# EAGLE schematic hobbyLights (EAGLE 7.6.0)

## Sheet 1 of 2
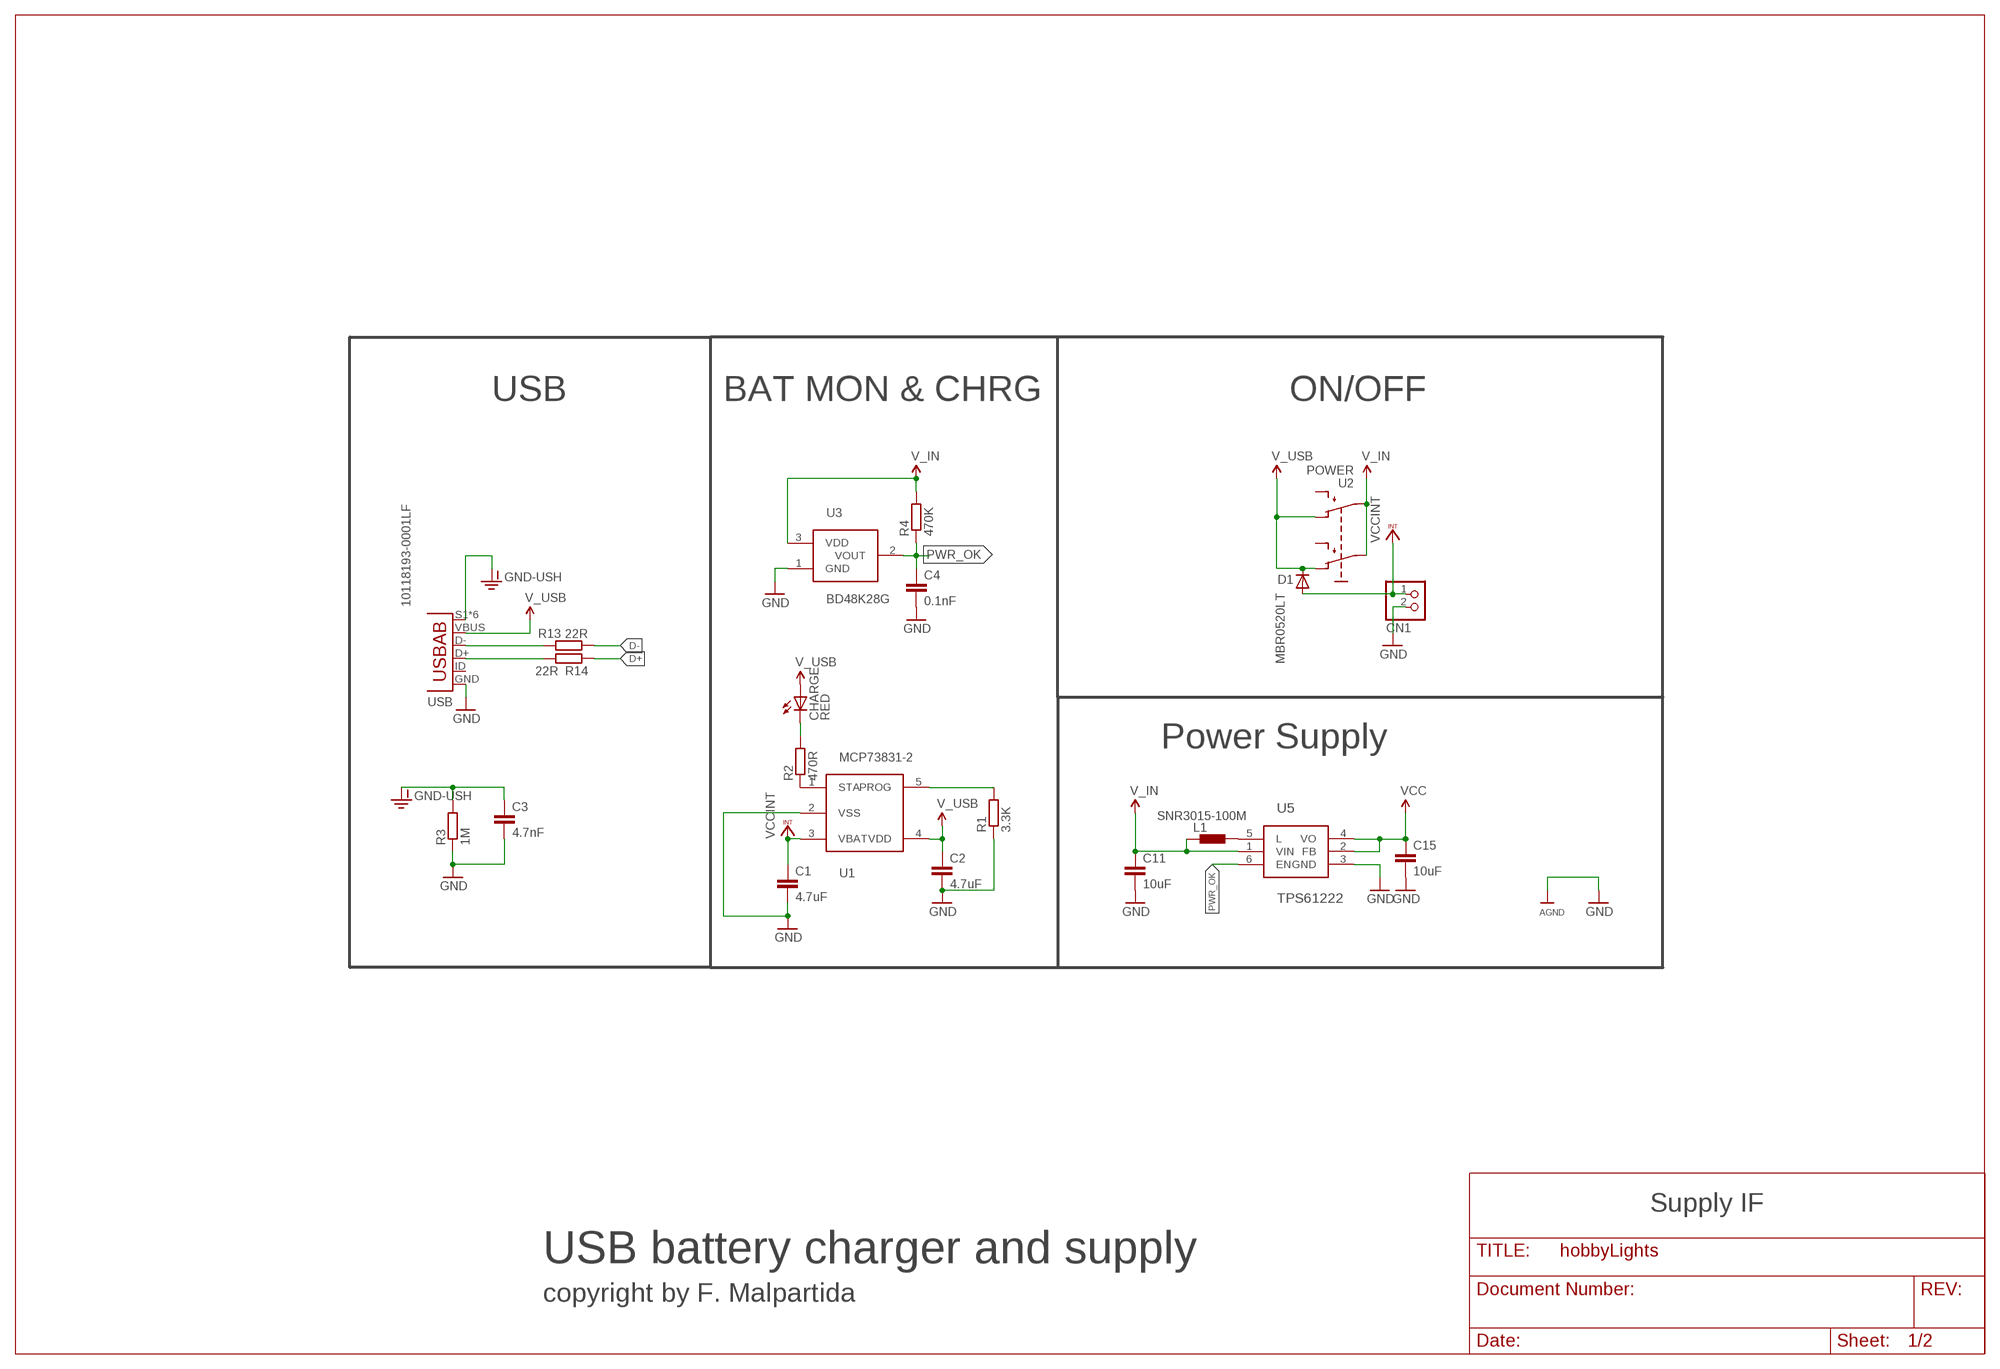
[diagram p0: schematic, sheet 1]

### Parts
C1  4.7uF  C-EUC0805  [C0805]
C2  4.7uF  C-EUC0805  [C0805]
C3  4.7nF  C-EUC0603  [C0603]
C4  0.1nF  C-EUC0603  [C0603]
C11  10uF  C-EUC0805  [C0805]
C15  10uF  C-EUC0805  [C0805]
CHARGE  RED  LEDCHIPLED_0805  [CHIPLED_0805]
CN1  JST_2PIN-THM-RA  [JST-PH-2-THM-RA]
D1  MBR0520LT  [SOD123]
L1  SNR3015-100M  SRN3015  [SRN3015]
R1  3.3K  R-EU_R0603  [R0603]
R2  470R  R-EU_R0603  [R0603]
R3  1M  R-EU_R0603  [R0603]
R4  470K  R-EU_R0603  [R0603]
R13  22R  R-EU_R0603  [R0603]
R14  22R  R-EU_R0603  [R0603]
U1  MCP73831-2  [SOT23-5]
U2  POWER  MINI_SWITCH  [SWITCH-JS202011]
U3  BD48K28G  BD48XXXBD48XXK  [SSOP3]
U5  TPS61222  [DCK]
USB  10118193-0001LF  USB_MICRO_AB10118193-0001LF  [USB_MICRO_B]

### Nets
D+: R14.1 ; also sheet 2
D-: R13.1 ; also sheet 2
GND: C1.2 C2.2 C3.2 C4.2 C11.2 C15.2 CN1.2 R1.1 R3.1 U1.2(VSS) U3.1(GND) U5.3(GND) USB.GND ; supply symbol labelled AGND ; also sheet 2
GND-ISO: C3.1 R3.2 USB.S1(SHIELD) USB.S2(SHIELD) USB.S3(SHIELD) USB.S4(SHIELD) USB.S5(SHIELD) USB.S6(SHIELD) ; supply symbol labelled GND-USH
N$4: R1.2 U1.5(PROG)
N$6: R2.1 U1.1(STA)
N$7: CHARGE.C R2.2
N$13: R13.2 USB.D-
N$14: R14.2 USB.D+
N$15: L1.2 U5.5(L)
PWR_OK: C4.1 R4.1 U3.2(VOUT) U5.6(EN)
V_BATT [vcc]: C11.1 L1.1 R4.2 U2.P2(P) U2.P5(P1) U3.3(VDD) U5.1(VIN) ; supply symbol labelled V_IN ; also sheet 2
V_USB [vcc]: C2.1 CHARGE.A D1.C U1.4(VDD) U2.P1(O) U2.P4(O1) USB.VBUS
VCC [vcc]: C15.1 U5.2(FB) U5.4(VO) ; also sheet 2
VCCINT [vcc]: C1.1 CN1.1 D1.A U1.3(VBAT)
Unconnected: U2.P3(S) U2.P6(S1) USB.ID(USBID)

### Notes on the sheet
- USB | BAT MON & CHRG | ON/OFF
- Power Supply
- Supply IF
- USB battery charger and supply
- copyright by F. Malpartida

## Sheet 2 of 2
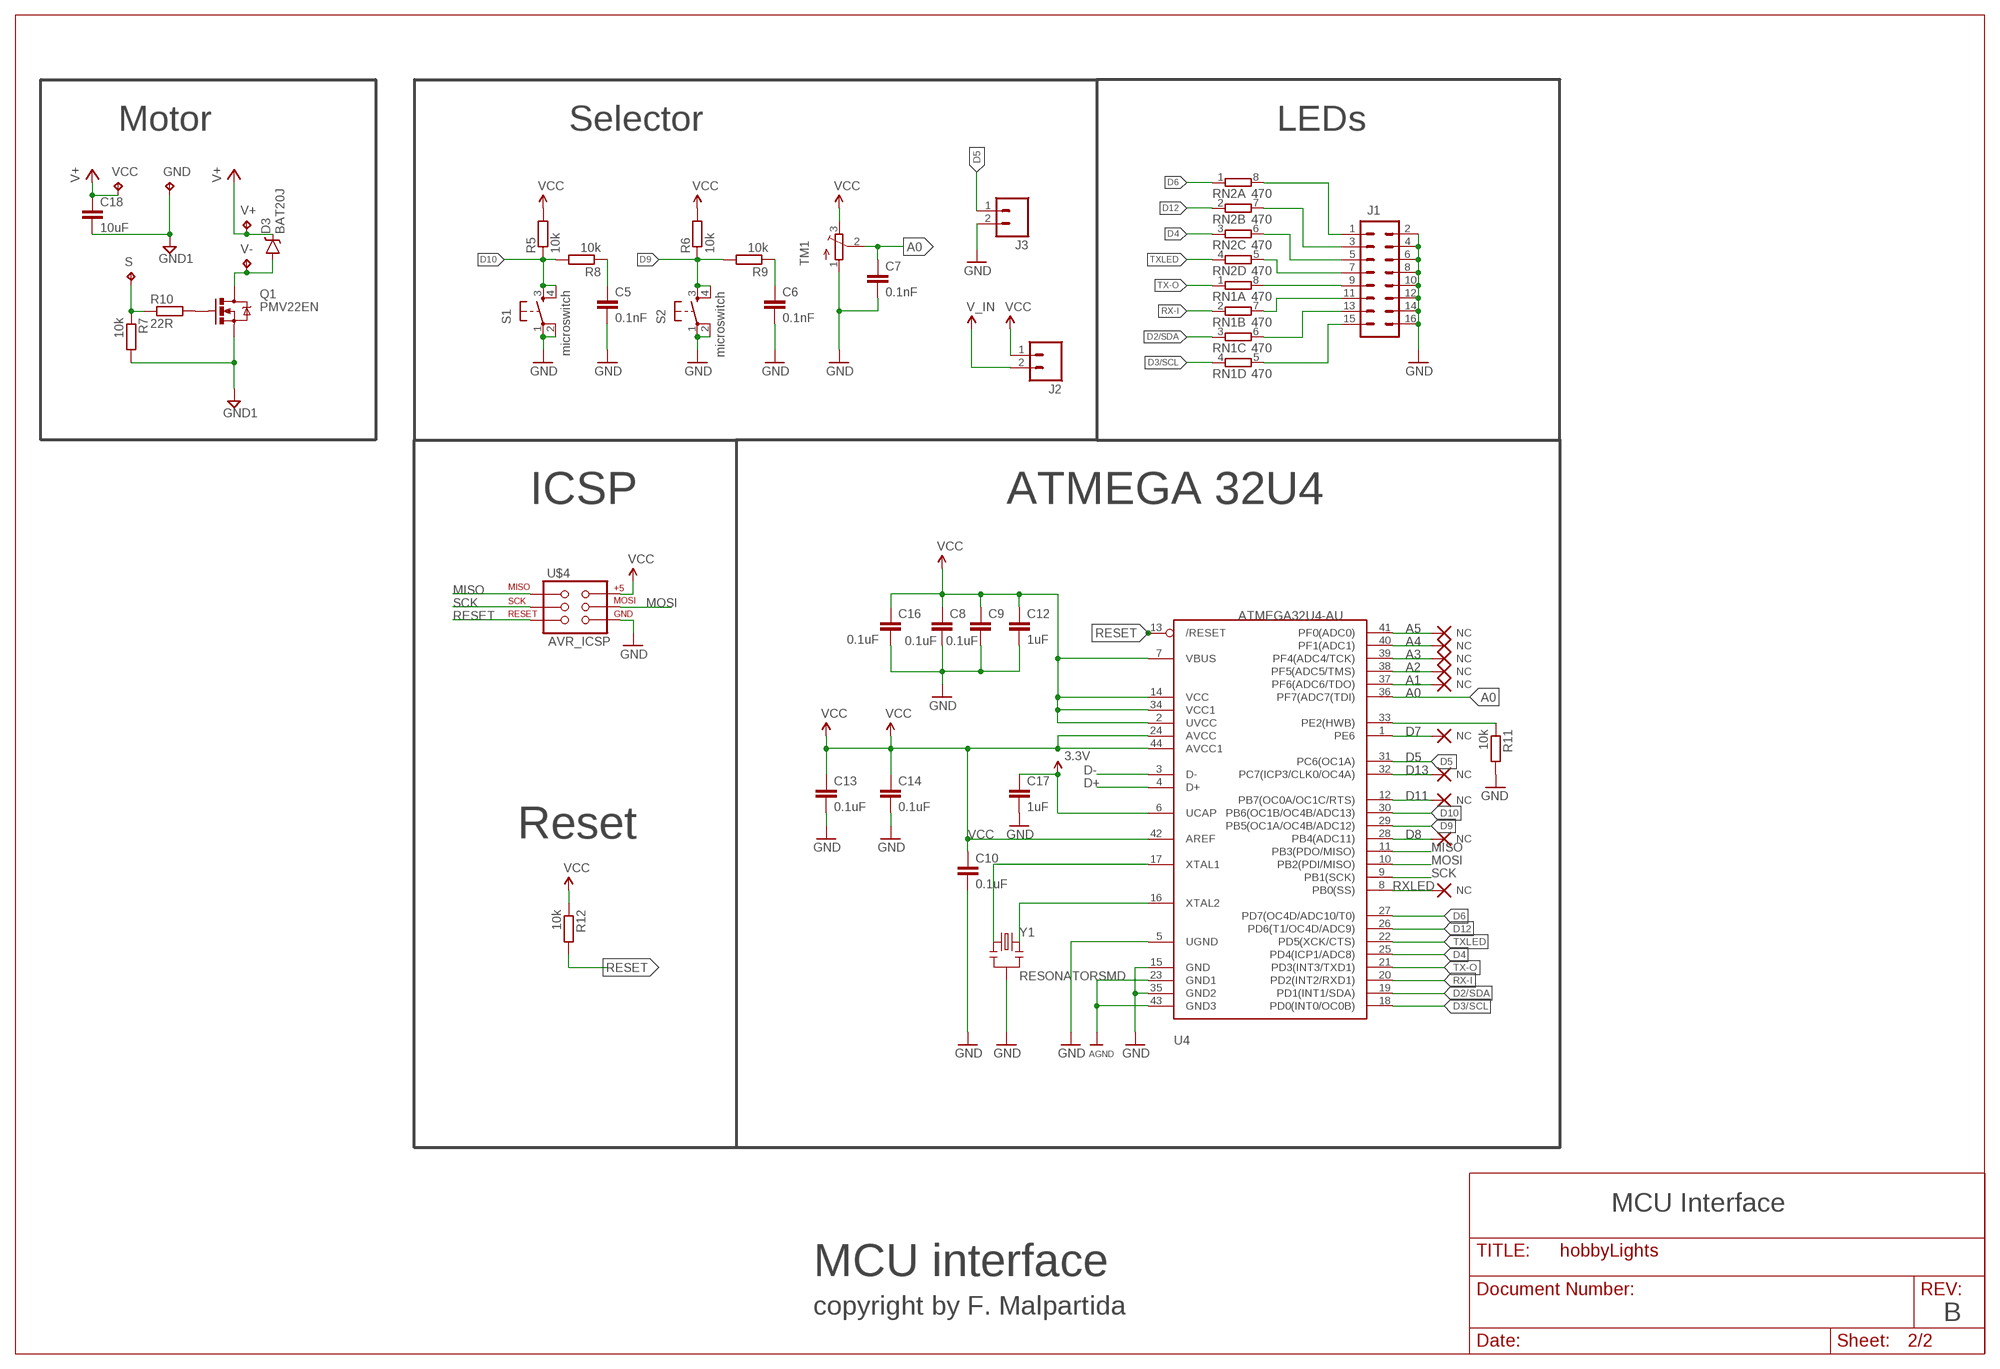
[diagram p1: schematic, sheet 2]

### Parts
C5  0.1nF  C-EUC0603  [C0603]
C6  0.1nF  C-EUC0603  [C0603]
C7  0.1nF  C-EUC0603  [C0603]
C8  0.1uF  C-EUC0603  [C0603]
C9  0.1uF  C-EUC0603  [C0603]
C10  0.1uF  C-EUC0603  [C0603]
C12  1uF  C-EUC0603  [C0603]
C13  0.1uF  C-EUC0603  [C0603]
C14  0.1uF  C-EUC0603  [C0603]
C16  0.1uF  C-EUC0603  [C0603]
C17  1uF  C-EUC0603  [C0603]
C18  10uF  C-EUC0805  [C0805]
D3  BAT20J  DIODE-SCHOTTKY-BAT20J  [SOD-323]
GND  TPTP20SQ  [TP20SQ]
J1  M08X2  [2X8]
J2  M02PTH  [1X02]
J3  M02PTH  [1X02]
Q1  PMV22EN  MOSFET-NCHANNELAO3404A  [SOT23-3]
R5  10k  R-EU_R0603  [R0603]
R6  10k  R-EU_R0603  [R0603]
R7  10k  R-EU_R0603  [R0603]
R8  10k  R-EU_R0603  [R0603]
R9  10k  R-EU_R0603  [R0603]
R10  22R  R-EU_R0603  [R0603]
R11  10k  R-EU_R0603  [R0603]
R12  10k  R-EU_R0603  [R0603]
RN1  470  4R-NEXBS8V  [EXBS8V]
RN2  470  4R-NEXBS8V  [EXBS8V]
S  TPTP20SQ  [TP20SQ]
S1  microswitch  SPARKFUN_TAC_SWITCHSMD  [SPARKFUN_TACTILE_SWITCH_SMD]
S2  microswitch  SPARKFUN_TAC_SWITCHSMD  [SPARKFUN_TACTILE_SWITCH_SMD]
TM1  TRIMPOTTC33X  [TC33X]
U4  ATMEGA32U4-AU  ADAFRUIT_ATMEGA32U4-AU  [ADAFRUIT_TQFP44]
U$4  AVR_ICSP  [ICSP_SMD]
U$6  NULL  (no package)
U$12  NULL  (no package)
U$13  NULL  (no package)
U$14  NULL  (no package)
U$15  NULL  (no package)
U$16  NULL  (no package)
U$19  NULL  (no package)
U$21  NULL  (no package)
U$22  NULL  (no package)
U$25  NULL  (no package)
V+  TPTP20SQ  [TP20SQ]
V-  TPTP20SQ  [TP20SQ]
VCC  TPTP20SQ  [TP20SQ]
Y1  RESONATORSMD  [RESONATOR-SMD]

### Nets
3.3V: C17.1 U4.6(UCAP)
A0: C7.1 TM1.2(S) U4.36(PF7(ADC7(TDI))
A1: U4.37(PF6(ADC6/TDO)) U$16.NC
A2: U4.38(PF5(ADC5/TMS)) U$15.NC
A3: U4.39(PF4(ADC4/TCK)) U$14.NC
A4: U4.40(PF1(ADC1)) U$13.NC
A5 [vcc]: U4.41(PF0(ADC0)) U$12.NC
D2/SDA: RN1.3 U4.19(PD1(INT1/SDA))
D3/SCL: RN1.4 U4.18(PD0(INT0/OC0B))
D4: RN2.3 U4.25(PD4(ICP1/ADC8))
D5: J3.1 U4.31(PC6(OC1A))
D6: RN2.1 U4.27(PD7(OC4D/ADC10/T0))
D7: U4.1(PE6) U$21.NC
D8: U4.28(PB4(ADC11)) U$25.NC
D9: R6.1 R9.2 S2.3 S2.4 U4.29(PB5(OC1A/OC4B/ADC12))
D10: R5.1 R8.2 S1.3 S1.4 U4.30(PB6(OC1B/OC4B/ADC13))
D11: U4.12(PB7(OC0A/OC1C/RTS)) U$6.NC
D12: RN2.2 U4.26(PD6(T1/OC4D/ADC9))
D13: U4.32(PC7(ICP3/CLK0/OC4A)) U$19.NC
D+: U4.4(D+) ; also sheet 1
D-: U4.3(D-) ; also sheet 1
GND: C5.2 C6.2 C7.2 C8.2 C9.2 C10.2 C12.2 C13.2 C14.2 C16.2 C17.2 J1.2 J1.4 J1.6 J1.8 J1.10 J1.12 J1.14 J1.16 J3.2 R11.2 S1.1 S1.2 S2.1 S2.2 TM1.1(A) U4.5(UGND) U4.15(GND) U4.23(GND1) U4.35(GND2) U4.43(GND3) U$4.GND Y1.2 ; supply symbol labelled AGND ; also sheet 1
GND1: C18.2 GND.TP Q1.2(S) R7.2
MISO: U4.11(PB3(PDO/MISO)) U$4.MISO
MOSI: U4.10(PB2(PDI/MISO)) U$4.MOSI
N$1: Q1.1(G) R10.2
N$2: C5.1 R8.1
N$3: U4.16(XTAL2) Y1.3
N$5: U4.17(XTAL1) Y1.1
N$8: R7.1 R10.1 S.TP
N$9: C6.1 R9.1
N$10: D3.A Q1.3(D) V-.TP
N$12: R11.1 U4.33(PE2(HWB))
N$16: J1.15 RN1.5
N$17: J1.13 RN1.6
N$18: J1.11 RN1.7
N$19: J1.9 RN1.8
N$20: J1.1 RN2.8
N$21: J1.3 RN2.7
N$22: J1.5 RN2.6
N$23: J1.7 RN2.5
RESET: R12.2 U4.13(/RESET) U$4.RESET
RX-I: RN1.2 U4.20(PD2(INT2/RXD1))
RXLED: U4.8(PB0(SS)) U$22.NC
SCK: U4.9(PB1(SCK)) U$4.SCK
TX-O: RN1.1 U4.21(PD3(INT3/TXD1))
TXLED: RN2.4 U4.22(PD5(XCK/CTS))
V+ [vcc]: C18.1 D3.C V+.TP VCC.TP
V_BATT [vcc]: J2.2 ; supply symbol labelled V_IN ; also sheet 1
VCC [vcc]: C8.1 C9.1 C10.1 C12.1 C13.1 C14.1 C16.1 J2.1 R5.2 R6.2 R12.1 TM1.3(E) U4.2(UVCC) U4.7(VBUS) U4.14(VCC) U4.24(AVCC) U4.34(VCC1) U4.42(AREF) U4.44(AVCC1) U$4.5V(+5V) ; also sheet 1

### Notes on the sheet
- Motor | Selector | LEDs
- ICSP | ATMEGA 32U4
- Reset
- MCU Interface
- MCU interface
- copyright by F. Malpartida | B

## Library data of the parts
C1 C2 C11 C15 C18 = rcl:C-EU: CAPACITOR, European symbol
C3-C10 C12-C14 C16 C17 = fmc:C-EU: CAPACITOR, European symbol
CHARGE = led:LED: LED OSRAM: - CHIPLED LG R971, LG N971, LY N971, LG Q971, LY Q971, LO R971, LY R971 LH N974, LH R974 LS Q976, LO Q976, LY Q976 LO Q996 - Hyper CHIPLED LW Q18S LB Q993, LB Q99A, LB R99A - SideLED LS A670, LO A670, LY A670, LG A670, LP A670 LB A673, LV A673, LT A673, LW A673 LH A674 LY A675 LS A676, LA A676, LO A676, LY A676, LW A676 LS A679, LY A679, LG A679 - Hyper Micro SIDELED® LS Y876, LA Y876, LO Y876, LY Y876 LT Y87S - SmartLED LW L88C, LW L88S LB L89C, LB L89S, LG L890 LS L89K, LO L89K, LY L89K LS L896, LA L896, LO L896, LY L896 - TOPLED LS T670, LO T670, LY T670, LG T670, LP T670 LSG T670, LSP T670, LSY T670, LOP T670, LYG T670 LG T671, LOG T671, LSG T671 LB T673, LV T673, LT T673, LW T673 LH T674 LS T676, LA T676, LO T676, LY T676, LB T676, LH T676, LSB T676, LW T676 LB T67C, LV T67C, LT T67C, LS T67K, LO T67K, LY T67K, LW E67C LS E67B, LA E67B, LO E67B, LY E67B, LB E67C, LV E67C, LT E67C LW T67C LS T679, LY T679, LG T679 LS T770, LO T770, LY T770, LG T770, LP T770 LB T773, LV T773, LT T773, LW T773 LH T774 LS E675, LA E675, LY E675, LS T675 LS T776, LA T776, LO T776, LY T776, LB T776 LHGB T686 LT T68C, LB T68C - Hyper Mini TOPLED® LB M676 - Mini TOPLED Santana® LG M470 LS M47K, LO M47K, LY M47K Source: http://www.osram.convergy.de LUXEON: - LUMILED® LXK2-PW12-R00, LXK2-PW12-S00, LXK2-PW14-U00, LXK2-PW14-V00 LXK2-PM12-R00, LXK2-PM12-S00, LXK2-PM14-U00 LXK2-PE12-Q00, LXK2-PE12-R00, LXK2-PE12-S00, LXK2-PE14-T00, LXK2-PE14-U00 LXK2-PB12-K00, LXK2-PB12-L00, LXK2-PB12-M00, LXK2-PB14-N00, LXK2-PB14-P00, LXK2-PB14-Q00 LXK2-PR12-L00, LXK2-PR12-M00, LXK2-PR14-Q00, LXK2-PR14-R00 LXK2-PD12-Q00, LXK2-PD12-R00, LXK2-PD12-S00 LXK2-PH12-R00, LXK2-PH12-S00 LXK2-PL12-P00, LXK2-PL12-Q00, LXK2-PL12-R00 Source: www.luxeon.com KINGBRIGHT: KA-3528ASYC Source: www.kingbright.com
CN1 = adafruit:JST_2PIN: JST 2-Pin Connectors of various flavors SMT-RA (S2B-PH-SM4) 4UConnector #17311 SMT (B2B-PH-SM4) THM-RA (S2B-PH) THM (B2B-PH)
D1 = diode:MBR0520LT: SCHOTTKY BARRIER RECTIFIER Source: http://onsemi.com .. MBR0520LT1-D.pdf
D3 = SparkFun-DiscreteSemi:DIODE-SCHOTTKY: Schottky diodes in SFE's production catalog BAT20J 1A 23V 0.62Vf RB751 120mA 40V 0.37Vf PMEG4005EJ 0.5A 40V 0.42Vf MBRA140 1A 40V 0.5Vf B340A 3A 40V SMA; PROD_ID: DIO-11623
GND S V+ V- VCC = testpad:TP: Test pad
J1 = SparkFun-Connectors:M08X2: .1" headers, two rows of 8 each
J2 J3 = SparkFun-Connectors:M02: Standard 2-pin 0.1" header. Use with - straight break away headers ( PRT-00116) - right angle break away headers (PRT-00553) - swiss pins (PRT-00743) - machine pins (PRT-00117) - female headers (PRT-00115) Molex polarized connector foot print use with: PRT-08233 with associated crimp pins and housings. 2.54_SCREWTERM for use with PRT-10571. 3.5mm Screw Terminal footprints for PRT-08084 5mm Screw Terminal footprints for use with PRT-08432
L1 = inductors:SRN3015
Q1 = SparkFun-DiscreteSemi:MOSFET-NCHANNEL: Common NMOSFET Parts MFG P/N Store ID Prod ID FDD8780 TRANS-09984 SI7820DN TRANS-11055 FDS6630A IC-08089 2N7002PW TRANS-11151 FQP30N06L COM-10213 TRANS-10060 BSS123LT1G TRANS-08345 BSS138 TRANS-00830 BS170 2N7000; PROD_ID: TRAN-12988
R1-R14 = fmc:R-EU_: RESISTOR, European symbol
RN1 RN2 = resistor-dil:4R-N: Array Chip Resistor Source: RS Component / Phycomp; OC_FARNELL: unknown; OC_NEWARK: unknown
S1 S2 = SAVMakerI:SPARKFUN_TAC_SWITCH: Momentary Switch Button commonly used for reset or general input. Spark Fun Electronics SKU : COM-00097
TM1 = adafruit:TRIMPOT: SMT trimmer potentiometer part number TC33X http://www.ladyada.net/library/eagle
U1 = fmc:MCP73831-2
U2 = fmc:MINI_SWITCH
U3 = fmc:BD48XXX
U4 = SAVMakerI:ADAFRUIT_ATMEGA32U4: http://www.ladyada.net/library/eagle
U5 = fmc:TPS61222
U$4 = fmc:AVR_ICSP
U$6 U$12-U$16 U$19 U$21 U$22 U$25 = fmc:NULL; _EXTERNAL_: NULL
USB = fmc:USB_MICRO_AB
Y1 = sparkfun_2:RESONATOR: Resonator Small SMD resonator. This is the itty bitty 10/20MHz resonators with built in caps. CSTCE10M0G55 and CSTCE20M0V53. Footprint has been reviewed closely but hasn't been tested yet.

## Net classes
1 vcc: width 0.203 mm, clearance 0.203 mm to class 0, clearance 0.203 mm